# Altium schematic sheet PWR_LTC7150S.SchDoc
size A3
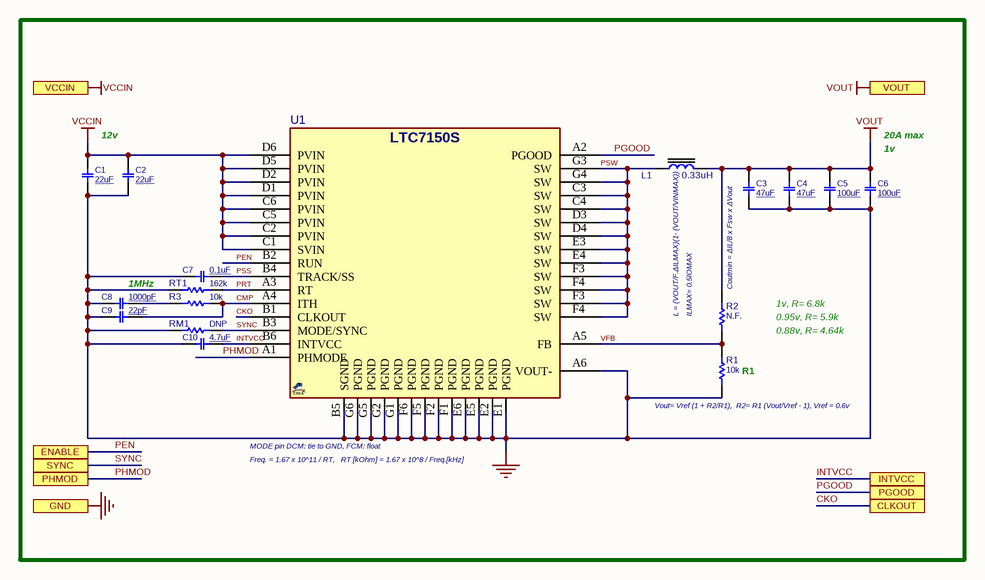
[diagram p0: PWR_LTC7150S.SchDoc]

## Parts
C1  22uF  [C1206]
C2  22uF  [C1206]
C3  47uF  [C0805]
C4  47uF  [C0805]
C5  100uF  [C0805]
C6  100uF  [C0805]
C7  0.1uF  [C0402]
C8  1000pF  [C0402]
C9  22pF  [C0402]
C10  4.7uF  [C0402]
L1  0.33uH  [L_7]
R1  10k  [R0402]
R2  N.F.  [R0402]
R3  10k  [R0402]
RM1  DNP  [R0402]
RT1  162k  [R0402]
U1  LTC7150S  [BGA80_42_5060]  (value not drawn)

## Ports
CLKOUT, ENABLE, GND, INTVCC, PGOOD, PHMOD, SYNC, VCCIN, VOUT

## Nets
GND: C1.2 C2.2 C3.2 C4.2 C5.2 C6.2 C7.1 C8.1 C9.1 C10.1 R1.1 RM1.1 RT1.1 U1.A6(VOUT-) U1.B5(SGND) U1.E1(PGND) U1.E2(PGND) U1.E5(PGND) U1.E6(PGND) U1.F1(PGND) U1.F2(PGND) U1.F5(PGND) U1.F6(PGND) U1.G1(PGND) U1.G2(PGND) U1.G5(PGND) U1.G6(PGND) ; port GND
VCCIN: C1.1 C2.1 U1.C1(SVIN) U1.C2(PVIN) U1.C5(PVIN) U1.C6(PVIN) U1.D1(PVIN) U1.D2(PVIN) U1.D5(PVIN) U1.D6(PVIN) ; port VCCIN
VOUT: C3.1 C4.1 C5.1 C6.1 L1.2 R2.2 ; port VOUT
CKO: U1.B1(CLKOUT) ; port CLKOUT
CMP: C9.2 R3.2 U1.A4(ITH)
INTVCC: C10.2 U1.B6(INTVCC) ; port INTVCC
PEN: U1.B2(RUN) ; port ENABLE
PGOOD: U1.A2(PGOOD) ; port PGOOD
PHMOD: U1.A1(PHMODE) ; port PHMOD
PRT: RT1.2 U1.A3(RT)
PSS: C7.2 U1.B4(TRACK/SS)
PSW: L1.1 U1.C3(SW) U1.C4(SW) U1.D3(SW) U1.D4(SW) U1.E3(SW) U1.E4(SW) U1.F3(SW) U1.F4(SW) U1.G3(SW) U1.G4(SW)
SYNC: RM1.2 U1.B3(MODE/SYNC) ; port SYNC
VFB: R1.2 R2.1 U1.A5(FB)
NetC8_2: C8.2 R3.1

## Notes on the sheet
- 12v
- 20A max
- (near C6) 1v
- (near C8) 1MHz
- (near L1) L = (VOUT/F.ΔILMAX)(1- (VOUT/VINMAX))
- (near R2) ILMAX= 0.5IOMAX
- Coutmin = ΔIL/8 x Fsw x ΔVout
- 1v, R= 6.8k
- 0.95v, R= 5.9k
- (near R1) R1
- 0.88v, R= 4.64k
- (near U1) MODE pin DCM: tie to GND, FCM: float
- (near R1) Vout= Vref (1 + R2/R1),  R2= R1 (Vout/Vref - 1), Vref = 0.6v
- Freq. = 1.67 x 10^11 / RT,   RT [kOhm] = 1.67 x 10^8 / Freq.[kHz]

## Library data of the parts
C1 C2 = CAP_SMD_MLCC: CAP, MLCC; PARAM: X5R, 20%; PARAM2: 25v; PRICE: 100= 1$; DESC: CAP, MLCC; MANF_P#: -; MANF: -; ASSEMBLY: ASSEMBLY; VALUE: 22uF
C3 C4 C10 = CAP_SMD_MLCC: CAP, MLCC; PARAM: X5R, 20%; PARAM2: 6.3v; PRICE: 100= 1$; DESC: CAP, MLCC; MANF_P#: -; MANF: -; ASSEMBLY: ASSEMBLY
  C3 C4: VALUE: 47uF
  C10: VALUE: 4.7uF
C5 C6 = CAP_SMD_MLCC: CAP, MLCC; PARAM: X5R, 20%; PARAM2: 4v; PRICE: 100= 1$; DESC: CAP, MLCC; MANF_P#: -; MANF: -; ASSEMBLY: ASSEMBLY; VALUE: 100uF
C7-C9 = CAP_SMD_MLCC: CAP, MLCC; PARAM2: 50v; PARAM: -; PRICE: 100= 1$; DESC: CAP, MLCC; MANF_P#: -; MANF: -; ASSEMBLY: ASSEMBLY
  C7: VALUE: 0.1uF
  C8: VALUE: 1000pF
  C9: VALUE: 22pF
L1 = INDPWR_SMD: INDUCTOR, POWER, SMD; MANF_P#: SRP7028A-R33M; VALUE: 0.33uH
R1-R3 RM1 RT1 = RES_SMD: RESISTOR, SMD; PARAM: -W; DESC: DESCRIPTION; DIST#: MOUSER; PARAM2: 1%; MANF_P#: -; MANF: -; ASSEMBLY: ASSEMBLY; PRICE: 100= 0.5$
  R1 R3: VALUE: 10k
  R2: VALUE: N.F.
  RM1: VALUE: DNP
  RT1: VALUE: 162k
U1 = VREG_LTC7150S_BGA: REG, Switching, Buck, 3.1~20V, 20A, BGA-42; MANF: Texas Instruments; PARAM: 20A, 0.4~3MHz, -40~125°C; PARAM2: 3.1~20VIN; MANF_P#: LTC7150SEY, LTC7150SIY; PRICE: 6$; ASSEMBLY: ASSEMBLY; VALUE: LTC7150S